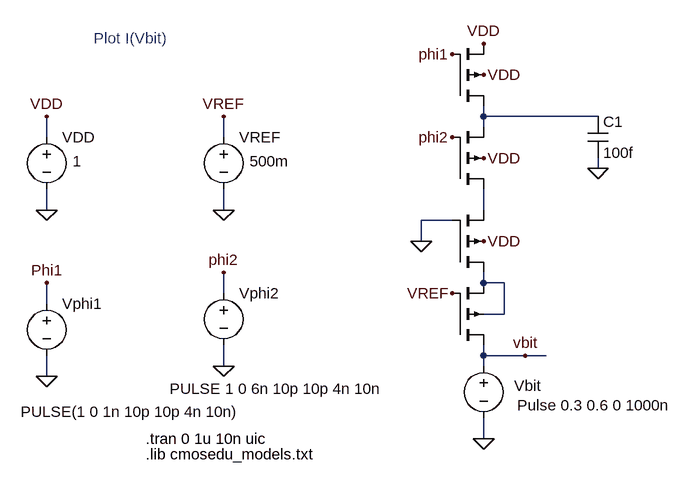
[diagram p0: schematic Fig17_12.asc]
Fig17_12.asc, the LTspice schematic file:
Version 4
SHEET 1 1556 680
WIRE 80 -400 80 -432
WIRE 80 -288 80 -320
WIRE 80 -144 80 -176
WIRE 80 -32 80 -64
WIRE 352 -400 352 -432
WIRE 352 -288 352 -320
WIRE 352 -160 352 -192
WIRE 352 -48 352 -80
WIRE 656 -240 656 -272
WIRE 704 -272 656 -272
WIRE 752 -432 752 -448
WIRE 752 -416 752 -432
WIRE 752 -288 752 -320
WIRE 752 -176 752 -192
WIRE 752 -64 752 -80
WIRE 752 -48 752 -64
WIRE 752 64 752 32
WIRE 784 -176 752 -176
WIRE 784 -128 752 -128
WIRE 784 -128 784 -176
WIRE 816 -64 752 -64
WIRE 848 -64 816 -64
WIRE 928 -432 752 -432
WIRE 928 -352 928 -368
FLAG 80 -288 0
FLAG 80 -432 VDD
FLAG 752 -496 VDD
FLAG 752 -544 VDD
FLAG 80 -32 0
FLAG 80 -176 Phi1
FLAG 352 -48 0
FLAG 352 -192 phi2
FLAG 752 -368 VDD
FLAG 752 -240 VDD
FLAG 656 -240 0
FLAG 704 -528 phi1
FLAG 704 -400 phi2
FLAG 752 64 0
FLAG 816 -64 vbit
FLAG 928 -352 0
FLAG 704 -160 VREF
FLAG 352 -288 0
FLAG 352 -432 VREF
SYMBOL voltage 80 -416 R0
WINDOW 123 0 0 Left 0
WINDOW 39 0 0 Left 0
WINDOW 3 40 53 Left 0
SYMATTR Value 1
SYMATTR InstName VDD
SYMBOL pmos4 704 -448 M180
WINDOW 0 56 32 Invisible 0
WINDOW 3 56 72 Invisible 0
SYMATTR InstName M3
SYMATTR Value P_50n
SYMATTR Value2 l=50n w=1u
SYMBOL voltage 80 -160 R0
WINDOW 123 0 0 Left 0
WINDOW 39 0 0 Left 0
WINDOW 3 -40 182 Left 0
SYMATTR Value PULSE(1 0 1n 10p 10p 4n 10n)
SYMATTR InstName Vphi1
SYMBOL voltage 352 -176 R0
WINDOW 123 0 0 Left 0
WINDOW 39 0 0 Left 0
WINDOW 3 -83 163 Left 0
SYMATTR Value PULSE 1 0 6n 10p 10p 4n 10n
SYMATTR InstName Vphi2
SYMBOL pmos4 704 -320 M180
WINDOW 0 56 32 Invisible 0
WINDOW 3 56 72 Invisible 0
SYMATTR InstName M1
SYMATTR Value P_50n
SYMATTR Value2 l=50n w=1u
SYMBOL pmos4 704 -192 M180
WINDOW 0 56 32 Invisible 0
WINDOW 3 56 72 Invisible 0
SYMATTR InstName M2
SYMATTR Value P_50n
SYMATTR Value2 l=50n w=1u
SYMBOL voltage 752 -64 R0
WINDOW 0 47 46 Left 0
WINDOW 3 52 76 Left 0
WINDOW 123 0 0 Left 0
WINDOW 39 0 0 Left 0
SYMATTR InstName Vbit
SYMATTR Value Pulse 0.3 0.6 0 1000n
SYMBOL cap 912 -432 R0
SYMATTR InstName C1
SYMATTR Value 100f
SYMBOL pmos4 704 -80 M180
WINDOW 0 56 32 Invisible 0
WINDOW 3 56 72 Invisible 0
SYMATTR InstName M4
SYMATTR Value P_50n
SYMATTR Value2 l=50n w=1u
SYMBOL voltage 352 -416 R0
WINDOW 123 0 0 Left 0
WINDOW 39 0 0 Left 0
WINDOW 3 40 53 Left 0
SYMATTR Value 500m
SYMATTR InstName VREF
TEXT 232 88 Left 0 !.lib cmosedu_models.txt
TEXT 232 64 Left 0 !.tran 0 1u 10n uic
TEXT 152 -552 Left 0 ;Plot I(Vbit)

The netlist it stands for:
* Fig17_12.asc
VDD VDD 0 1
M3 N001 Phi1 VDD VDD P_50n l=50n w=1u
Vphi1 Phi1 0 PULSE(1 0 1n 10p 10p 4n 10n)
Vphi2 phi2 0 PULSE 1 0 6n 10p 10p 4n 10n
M1 N002 phi2 N001 VDD P_50n l=50n w=1u
M2 N003 0 N002 VDD P_50n l=50n w=1u
Vbit vbit 0 Pulse 0.3 0.6 0 1000n
C1 N001 0 100f
M4 vbit VREF N003 N003 P_50n l=50n w=1u
VREF VREF 0 500m
.model NMOS NMOS
.model PMOS PMOS
.lib standard.mos
.lib cmosedu_models.txt
.tran 0 1u 10n uic
* Plot I(Vbit)
.backanno
.end